# EAGLE schematic Main_v1 (EAGLE 9.7.0)
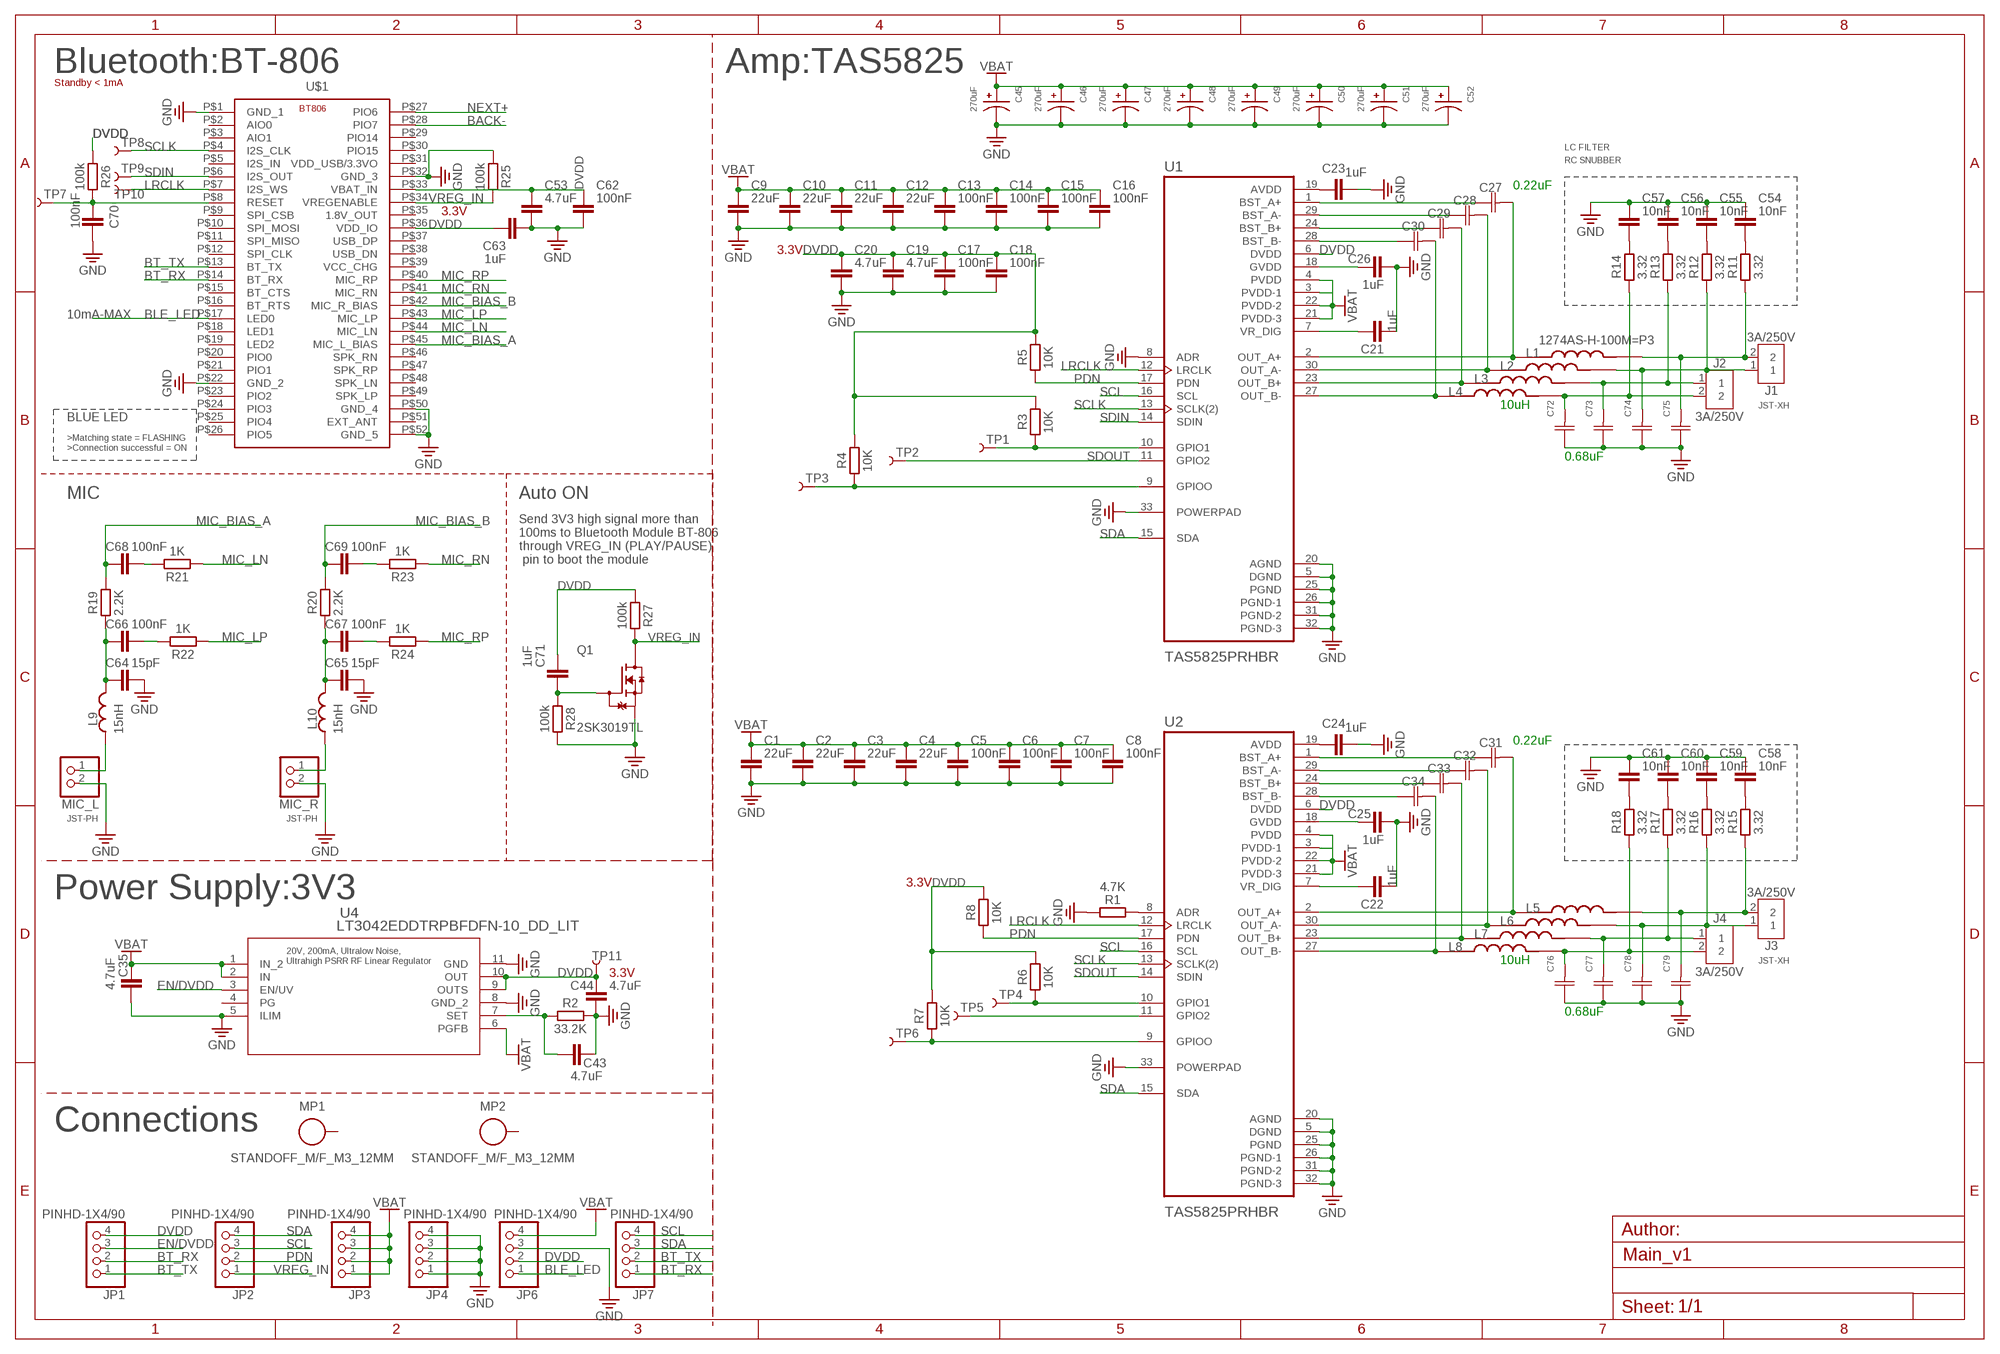
[diagram p0: schematic, sheet 1]

## Parts
C1  22uF  C_CHIP-0805(2012-METRIC)  [CAPC2012X110]
C2  22uF  C_CHIP-0805(2012-METRIC)  [CAPC2012X110]
C3  22uF  C_CHIP-0805(2012-METRIC)  [CAPC2012X110]
C4  22uF  C_CHIP-0805(2012-METRIC)  [CAPC2012X110]
C5  100nF  C_CHIP-0805(2012-METRIC)  [CAPC2012X110]
C6  100nF  C_CHIP-0805(2012-METRIC)  [CAPC2012X110]
C7  100nF  C_CHIP-0805(2012-METRIC)  [CAPC2012X110]
C8  100nF  C_CHIP-0805(2012-METRIC)  [CAPC2012X110]
C9  22uF  C_CHIP-0805(2012-METRIC)  [CAPC2012X110]
C10  22uF  C_CHIP-0805(2012-METRIC)  [CAPC2012X110]
C11  22uF  C_CHIP-0805(2012-METRIC)  [CAPC2012X110]
C12  22uF  C_CHIP-0805(2012-METRIC)  [CAPC2012X110]
C13  100nF  C_CHIP-0805(2012-METRIC)  [CAPC2012X110]
C14  100nF  C_CHIP-0805(2012-METRIC)  [CAPC2012X110]
C15  100nF  C_CHIP-0805(2012-METRIC)  [CAPC2012X110]
C16  100nF  C_CHIP-0805(2012-METRIC)  [CAPC2012X110]
C17  100nF  C_CHIP-0805(2012-METRIC)  [CAPC2012X110]
C18  100nF  C_CHIP-0805(2012-METRIC)  [CAPC2012X110]
C19  4.7uF  C_CHIP-1206(3216-METRIC)  [CAPC3216X135]
C20  4.7uF  C_CHIP-1206(3216-METRIC)  [CAPC3216X135]
C21  1uF  C_CHIP-0805(2012-METRIC)  [CAPC2012X110]
C22  1uF  C_CHIP-0805(2012-METRIC)  [CAPC2012X110]
C23  1uF  C_CHIP-0805(2012-METRIC)  [CAPC2012X110]
C24  1uF  C_CHIP-0805(2012-METRIC)  [CAPC2012X110]
C25  1uF  C_CHIP-0805(2012-METRIC)  [CAPC2012X110]
C26  1uF  C_CHIP-0805(2012-METRIC)  [CAPC2012X110]
C27  0.22uF  PHE426HJ6220JR05CAPM7.2X7.2_5_1_VIS  [CAPM7.2X7.2_5_1_VIS]
C28  0.22uF  PHE426HJ6220JR05CAPM7.2X7.2_5_1_VIS  [CAPM7.2X7.2_5_1_VIS]
C29  0.22uF  PHE426HJ6220JR05CAPM7.2X7.2_5_1_VIS  [CAPM7.2X7.2_5_1_VIS]
C30  0.22uF  PHE426HJ6220JR05CAPM7.2X7.2_5_1_VIS  [CAPM7.2X7.2_5_1_VIS]
C31  0.22uF  PHE426HJ6220JR05CAPM7.2X7.2_5_1_VIS  [CAPM7.2X7.2_5_1_VIS]
C32  0.22uF  PHE426HJ6220JR05CAPM7.2X7.2_5_1_VIS  [CAPM7.2X7.2_5_1_VIS]
C33  0.22uF  PHE426HJ6220JR05CAPM7.2X7.2_5_1_VIS  [CAPM7.2X7.2_5_1_VIS]
C34  0.22uF  PHE426HJ6220JR05CAPM7.2X7.2_5_1_VIS  [CAPM7.2X7.2_5_1_VIS]
C35  4.7uF  C_CHIP-0805(2012-METRIC)  [CAPC2012X110]
C43  4.7uF  C_CHIP-0805(2012-METRIC)  [CAPC2012X110]
C44  4.7uF  C_CHIP-0805(2012-METRIC)  [CAPC2012X110]
C45  270uF  16SVPG270M  [CAP_16SVPG270M]
C46  270uF  16SVPG270M  [CAP_16SVPG270M]
C47  270uF  16SVPG270M  [CAP_16SVPG270M]
C48  270uF  16SVPG270M  [CAP_16SVPG270M]
C49  270uF  16SVPG270M  [CAP_16SVPG270M]
C50  270uF  16SVPG270M  [CAP_16SVPG270M]
C51  270uF  16SVPG270M  [CAP_16SVPG270M]
C52  270uF  16SVPG270M  [CAP_16SVPG270M]
C53  4.7uF  C_CHIP-0805(2012-METRIC)  [CAPC2012X110]
C54  10nF  C_CHIP-0805(2012-METRIC)  [CAPC2012X110]
C55  10nF  C_CHIP-0805(2012-METRIC)  [CAPC2012X110]
C56  10nF  C_CHIP-0805(2012-METRIC)  [CAPC2012X110]
C57  10nF  C_CHIP-0805(2012-METRIC)  [CAPC2012X110]
C58  10nF  C_CHIP-0805(2012-METRIC)  [CAPC2012X110]
C59  10nF  C_CHIP-0805(2012-METRIC)  [CAPC2012X110]
C60  10nF  C_CHIP-0805(2012-METRIC)  [CAPC2012X110]
C61  10nF  C_CHIP-0805(2012-METRIC)  [CAPC2012X110]
C62  100nF  C_CHIP-0805(2012-METRIC)  [CAPC2012X110]
C63  1uF  C_CHIP-0805(2012-METRIC)  [CAPC2012X110]
C64  15pF  C_CHIP-0402(1005-METRIC)  [CAPC1005X60]
C65  15pF  C_CHIP-0402(1005-METRIC)  [CAPC1005X60]
C66  100nF  C_CHIP-0402(1005-METRIC)  [CAPC1005X60]
C67  100nF  C_CHIP-0402(1005-METRIC)  [CAPC1005X60]
C68  100nF  C_CHIP-0402(1005-METRIC)  [CAPC1005X60]
C69  100nF  C_CHIP-0402(1005-METRIC)  [CAPC1005X60]
C70  100nF  C_CHIP-0402(1005-METRIC)  [CAPC1005X60]
C71  1uF  C_CHIP-0805(2012-METRIC)  [CAPC2012X110]
C72  MMK5684J63J03L16.5TR18CAPM7.2X4.5_5_VIS  [CAPM7.2X4.5_5_VIS]
C73  MMK5684J63J03L16.5TR18CAPM7.2X4.5_5_VIS  [CAPM7.2X4.5_5_VIS]
C74  MMK5684J63J03L16.5TR18CAPM7.2X4.5_5_VIS  [CAPM7.2X4.5_5_VIS]
C75  MMK5684J63J03L16.5TR18CAPM7.2X4.5_5_VIS  [CAPM7.2X4.5_5_VIS]
C76  MMK5684J63J03L16.5TR18CAPM7.2X4.5_5_VIS  [CAPM7.2X4.5_5_VIS]
C77  MMK5684J63J03L16.5TR18CAPM7.2X4.5_5_VIS  [CAPM7.2X4.5_5_VIS]
C78  MMK5684J63J03L16.5TR18CAPM7.2X4.5_5_VIS  [CAPM7.2X4.5_5_VIS]
C79  MMK5684J63J03L16.5TR18CAPM7.2X4.5_5_VIS  [CAPM7.2X4.5_5_VIS]
J1  3A/250V  B2B-XH-A  [B2B-XH-A]
J2  3A/250V  B2B-XH-A  [B2B-XH-A]
J3  3A/250V  B2B-XH-A  [B2B-XH-A]
J4  3A/250V  B2B-XH-A  [B2B-XH-A]
JP1  PINHD-1X4/90  [1X04/90]
JP2  PINHD-1X4/90  [1X04/90]
JP3  PINHD-1X4/90  [1X04/90]
JP4  PINHD-1X4/90  [1X04/90]
JP6  PINHD-1X4/90  [1X04/90]
JP7  PINHD-1X4/90  [1X04/90]
L1  1274AS-H-100M=P3  [IND_1274AS-H-100M=P3]
L2  1274AS-H-100M=P3  [IND_1274AS-H-100M=P3]
L3  1274AS-H-100M=P3  [IND_1274AS-H-100M=P3]
L4  1274AS-H-100M=P3  [IND_1274AS-H-100M=P3]
L5  1274AS-H-100M=P3  [IND_1274AS-H-100M=P3]
L6  1274AS-H-100M=P3  [IND_1274AS-H-100M=P3]
L7  1274AS-H-100M=P3  [IND_1274AS-H-100M=P3]
L8  1274AS-H-100M=P3  [IND_1274AS-H-100M=P3]
L9  15nH  L_CHIP-0402(1006-METRIC)  [INDC1006X60N]
L10  15nH  L_CHIP-0402(1006-METRIC)  [INDC1006X60N]
MIC_L  JST_2PIN-THM  [JST-PH-2-THM]
MIC_R  JST_2PIN-THM  [JST-PH-2-THM]
MP1  STANDOFF_M/F_M3_12MM  [STANDOFF_HEX_MALE-FEMALE_550X1200_M3X0.5_MTGP850H320]
MP2  STANDOFF_M/F_M3_12MM  [STANDOFF_HEX_MALE-FEMALE_550X1200_M3X0.5_MTGP850H320]
Q1  2SK3019TL  [TRANS_2SK3019TL]
R1  4.7K  R_CHIP-0402(1005-METRIC)  [RESC1005X40]
R2  33.2K  R_CHIP-0402(1005-METRIC)  [RESC1005X40]
R3  10K  R_CHIP-0402(1005-METRIC)  [RESC1005X40]
R4  10K  R_CHIP-0402(1005-METRIC)  [RESC1005X40]
R5  10K  R_CHIP-0402(1005-METRIC)  [RESC1005X40]
R6  10K  R_CHIP-0402(1005-METRIC)  [RESC1005X40]
R7  10K  R_CHIP-0402(1005-METRIC)  [RESC1005X40]
R8  10K  R_CHIP-0402(1005-METRIC)  [RESC1005X40]
R11  3.32  R_CHIP-0402(1005-METRIC)  [RESC1005X40]
R12  3.32  R_CHIP-0402(1005-METRIC)  [RESC1005X40]
R13  3.32  R_CHIP-0402(1005-METRIC)  [RESC1005X40]
R14  3.32  R_CHIP-0402(1005-METRIC)  [RESC1005X40]
R15  3.32  R_CHIP-0402(1005-METRIC)  [RESC1005X40]
R16  3.32  R_CHIP-0402(1005-METRIC)  [RESC1005X40]
R17  3.32  R_CHIP-0402(1005-METRIC)  [RESC1005X40]
R18  3.32  R_CHIP-0402(1005-METRIC)  [RESC1005X40]
R19  2.2K  R_CHIP-0402(1005-METRIC)  [RESC1005X40]
R20  2.2K  R_CHIP-0402(1005-METRIC)  [RESC1005X40]
R21  1K  R_CHIP-0402(1005-METRIC)  [RESC1005X40]
R22  1K  R_CHIP-0402(1005-METRIC)  [RESC1005X40]
R23  1K  R_CHIP-0402(1005-METRIC)  [RESC1005X40]
R24  1K  R_CHIP-0402(1005-METRIC)  [RESC1005X40]
R25  100k  R_CHIP-0402(1005-METRIC)  [RESC1005X40]
R26  100k  R_CHIP-0402(1005-METRIC)  [RESC1005X40]
R27  100k  R_CHIP-0402(1005-METRIC)  [RESC1005X40]
R28  100k  R_CHIP-0402(1005-METRIC)  [RESC1005X40]
TP1  TEST-POINT3  [PAD.03X.03]
TP2  TEST-POINT3  [PAD.03X.03]
TP3  TEST-POINT3  [PAD.03X.03]
TP4  TEST-POINT3  [PAD.03X.03]
TP5  TEST-POINT3  [PAD.03X.03]
TP6  TEST-POINT3  [PAD.03X.03]
TP7  TEST-POINT3  [PAD.03X.03]
TP8  TEST-POINT3X5  [PAD.03X.05]
TP9  TEST-POINT3X5  [PAD.03X.05]
TP10  TEST-POINT3X5  [PAD.03X.05]
TP11  TEST-POINT3X5  [PAD.03X.05]
U1  TAS5825PRHBR  [IC_ADS125H01IRHBT]
U2  TAS5825PRHBR  [IC_ADS125H01IRHBT]
U4  LT3042EDDTRPBFDFN-10_DD_LIT  [DFN-10_DD_LIT]
U$1  BT806  [BT806]

## Nets
BACK-: U$1.P$28(PIO7)
BLE_LED: JP6.1 U$1.P$17(LED0)
BT_RX: JP1.2 JP7.1 U$1.P$14(BT_RX)
BT_TX: JP1.1 JP7.2 U$1.P$13(BT_TX)
DVDD: C17.1 C18.1 C19.1 C20.1 C44.2 C53.1 C62.1 C63.1 C71.1 JP1.4 JP6.2 R3.2 R4.2 R5.2 R6.2 R7.2 R8.2 R26.1 R27.1 TP11.P$1 U1.6(DVDD) U2.6(DVDD) U4.9(OUTS) U4.10(OUT) U$1.P$33(VBAT_IN) U$1.P$36(VDD_IO)
EN/DVDD: JP1.3 U4.3(EN/UV)
GND: C1.2 C2.2 C3.2 C4.2 C5.2 C6.2 C7.2 C8.2 C9.2 C10.2 C11.2 C12.2 C13.2 C14.2 C15.2 C16.2 C17.2 C18.2 C19.2 C20.2 C21.2 C22.2 C23.2 C24.2 C25.2 C26.2 C35.1 C43.2 C44.1 C45.2 C46.2 C47.2 C48.2 C49.2 C50.2 C51.2 C52.2 C53.2 C54.1 C55.1 C56.1 C57.1 C58.1 C59.1 C60.1 C61.1 C62.2 C63.2 C64.2 C65.2 C70.1 C72.1 C73.1 C74.1 C75.1 C76.1 C77.1 C78.1 C79.1 JP4.1 JP4.2 JP4.3 JP4.4 JP6.3 MIC_L.2 MIC_R.2 Q1.1(S) R1.1 R2.2 R25.1 R28.2 U1.5(DGND) U1.8(ADR) U1.20(AGND) U1.25(PGND) U1.26(PGND-1) U1.31(PGND-2) U1.32(PGND-3) U1.33(POWERPAD) U2.5(DGND) U2.20(AGND) U2.25(PGND) U2.26(PGND-1) U2.31(PGND-2) U2.32(PGND-3) U2.33(POWERPAD) U4.5(ILIM) U4.8(GND_2) U4.11(GND) U$1.P$1(GND_1) U$1.P$22(GND_2) U$1.P$32(GND_3) U$1.P$50(GND_4) U$1.P$52(GND_5)
LRCLK: TP10.P$1 U1.12(LRCLK) U2.12(LRCLK) U$1.P$7(I2S_WS)
MIC_BIAS_A: C68.1 R19.2 U$1.P$45(MIC_L_BIAS)
MIC_BIAS_B: C69.1 R20.2 U$1.P$42(MIC_R_BIAS)
MIC_LN: R21.1 U$1.P$44(MIC_LN)
MIC_LP: R22.1 U$1.P$43(MIC_LP)
MIC_RN: R23.1 U$1.P$41(MIC_RN)
MIC_RP: R24.1 U$1.P$40(MIC_RP)
N$1: R1.2 U2.8(ADR)
N$2: C24.1 U2.19(AVDD)
N$3: C23.1 U1.19(AVDD)
N$4: C26.1 U1.18(GVDD)
N$5: C21.1 U1.7(VR_DIG)
N$6: C25.1 U2.18(GVDD)
N$7: C22.1 U2.7(VR_DIG)
N$8: C27.1 U1.1(BST_A+)
N$9: C28.1 U1.29(BST_A-)
N$10: C29.1 U1.24(BST_B+)
N$11: C30.1 U1.28(BST_B-)
N$12: C31.1 U2.1(BST_A+)
N$13: C32.1 U2.29(BST_A-)
N$14: C33.1 U2.24(BST_B+)
N$15: C34.1 U2.28(BST_B-)
N$16: C27.2 L1.1 U1.2(OUT_A+)
N$17: C28.2 L2.1 U1.30(OUT_A-)
N$18: C29.2 L3.1 U1.23(OUT_B+)
N$19: C30.2 L4.1 U1.27(OUT_B-)
N$20: C31.2 L5.1 U2.2(OUT_A+)
N$21: C32.2 L6.1 U2.30(OUT_A-)
N$22: C33.2 L7.1 U2.23(OUT_B+)
N$23: C34.2 L8.1 U2.27(OUT_B-)
N$24: C77.2 J4.1 L7.2 R17.1
N$25: C78.2 J3.1 L6.2 R16.1
N$26: C79.2 J3.2 L5.2 R15.1
N$27: C72.2 J2.2 L4.2 R14.1
N$28: C75.2 J1.2 L1.2 R11.1
N$29: C76.2 J4.2 L8.2 R18.1
N$30: C74.2 J1.1 L2.2 R12.1
N$31: C73.2 J2.1 L3.2 R13.1
N$32: C43.1 R2.1 U4.7(SET)
N$34: R3.1 TP1.P$1 U1.10(GPIO1)
N$35: R6.1 TP4.P$1 U2.10(GPIO1)
N$36: R4.1 TP3.P$1 U1.9(GPIOO)
N$37: TP5.P$1 U2.11(GPIO2)
N$38: R7.1 TP6.P$1 U2.9(GPIOO)
N$43: C54.2 R11.2
N$44: C55.2 R12.2
N$45: C56.2 R13.2
N$46: C57.2 R14.2
N$47: C58.2 R15.2
N$48: C59.2 R16.2
N$49: C60.2 R17.2
N$50: C61.2 R18.2
N$51: L9.1 MIC_L.1
N$54: L10.1 MIC_R.1
N$55: C64.1 C66.1 L9.2 R19.1
N$56: C70.2 R26.2 TP7.P$1 U$1.P$8(RESET)
N$58: C66.2 R22.2
N$59: C69.2 R23.2
N$60: C67.2 R24.2
N$61: C68.2 R21.2
N$63: C71.2 Q1.2(G) R28.1
N$64: C65.1 C67.1 L10.2 R20.1
NEXT+: U$1.P$27(PIO6)
PDN: JP2.2 R5.1 R8.1 U1.17(PDN) U2.17(PDN)
SCL: JP2.3 JP7.4 U1.16(SCL) U2.16(SCL)
SCLK: TP8.P$1 U1.13(SCLK(2)) U2.13(SCLK(2)) U$1.P$4(I2S_CLK)
SDA: JP2.4 JP7.3 U1.15(SDA) U2.15(SDA)
SDIN: TP9.P$1 U1.14(SDIN) U$1.P$6(I2S_OUT)
SDOUT: TP2.P$1 U1.11(GPIO2) U2.14(SDIN)
VCC: C1.1 C2.1 C3.1 C4.1 C5.1 C6.1 C7.1 C8.1 C9.1 C10.1 C11.1 C12.1 C13.1 C14.1 C15.1 C16.1 C35.2 C45.1 C46.1 C47.1 C48.1 C49.1 C50.1 C51.1 C52.1 JP3.1 JP3.2 JP3.3 JP3.4 JP6.4 U1.3(PVDD-1) U1.4(PVDD) U1.21(PVDD-3) U1.22(PVDD-2) U2.3(PVDD-1) U2.4(PVDD) U2.21(PVDD-3) U2.22(PVDD-2) U4.1(IN_2) U4.2(IN) U4.6(PGFB) ; supply symbol labelled VBAT
VREG_IN: JP2.1 Q1.3(D) R25.2 R27.2 U$1.P$34(VREGENABLE)
Unconnected: MP1.1 MP2.1 U$1.P$2(AIO0) U$1.P$3(AIO1) U$1.P$5(I2S_IN) U$1.P$9(SPI_CSB) U$1.P$10(SPI_MOSI) U$1.P$11(SPI_MISO) U$1.P$12(SPI_CLK) U$1.P$15(BT_CTS) U$1.P$16(BT_RTS) U$1.P$18(LED1) U$1.P$19(LED2) U$1.P$20(PIO0) U$1.P$21(PIO1) U$1.P$23(PIO2) U$1.P$24(PIO3) U$1.P$25(PIO4) U$1.P$26(PIO5) U$1.P$29(PIO14) U$1.P$30(PIO15) U$1.P$31(VDD_USB/3.3VO) U$1.P$35(1.8V_OUT) U$1.P$37(USB_DP) U$1.P$38(USB_DN) U$1.P$39(VCC_CHG) U$1.P$46(SPK_RN) U$1.P$47(SPK_RP) U$1.P$48(SPK_LN) U$1.P$49(SPK_LP) U$1.P$51(EXT_ANT)

## Notes on the sheet
- Bluetooth:BT-806 | Amp:TAS5825
- Standby < 1mA
- LC FILTER
- RC SNUBBER
- 0.22uF
- 3.3V
- 3.3V
- 10mA-MAX
- 10uH | JST-XH
- BLUE LED
- >Matching state = FLASHING
  >Connection successful = ON
- 0.68uF
- MIC | Auto ON
- Send 3V3 high signal more than 
  100ms to Bluetooth Module BT-806 
  through VREG_IN (PLAY/PAUSE)
   pin to boot the module
- 0.22uF
- JST-PH | JST-PH
- 3.3V
- Power Supply:3V3
- 20V, 200mA, Ultralow Noise,
  Ultrahigh PSRR RF Linear Regulator
- 10uH | JST-XH
- 3.3V
- 0.68uF
- Connections

## Power pins joined to a net without a drawn wire
PG: U4.4(PG)

## Library data of the parts
C1-C26 C35 C43 C44 C53-C71 = Capacitor:C: Capacitor - Generic; CATEGORY: Capacitor
C27-C34 = 0.22uF:PHE426HJ6220JR05; COPYRIGHT: Copyright (C) 2021 Ultra Librarian. All rights reserved.; DIGI-KEY_PART_NUMBER_1: 399-PHE426HJ6220JR05-ND; MANUFACTURER_PART_NUMBER: PHE426HJ6220JR05; MFR_NAME: Vishay
C45-C52 = 16SVPG270M:16SVPG270M; MANUFACTURER: Panasonic; MAXIMUM_PACKAGE_HEIGHT: 9.9mm; PARTREV: 05-Mar-21; STANDARD: Manufacturer Recommendations
C72-C79 = MMK5684J63J03L16.5TR18:MMK5684J63J03L16.5TR18; COPYRIGHT: Copyright (C) 2022 Ultra Librarian. All rights reserved.; DIGI-KEY_PART_NUMBER_1: 399-MMK5684J63J03L16.5TR18CT-ND; DIGI-KEY_PART_NUMBER_2: 399-MMK5684J63J03L16.5TR18DKR-ND; DIGI-KEY_PART_NUMBER_3: 399-MMK5684J63J03L16.5TR18TR-ND; MANUFACTURER_PART_NUMBER: MMK5684J63J03L16.5TR18; MFR_NAME: Vishay
J1-J4 = Connector:B2B-XH-A: XH Connector Top Entry - 2POS Details see: Datasheet <http://www.jst-mfg.com/product/pdf/eng/eXH.pdf>; CATEGORY: CONNECTOR; DESCRIPTION: 2.5mm pitch/disconnectable crimp style connector; MANUFACTURER: JST (XH CONNECTOR); MPN: B2B-XH-A; OPERATING_TEMPERATURE: -25°C ~ 85°C; PART_STATUS: ACTIVE; ROHS_COMPLIANT: COMPLIANT; SERIES: B_B-XH-A; SUB_CATEGORY: Through hole connector; TYPE: top entry
JP1-JP4 JP6 JP7 = Connector:PINHD-1X4: PIN HEADER; CATEGORY: CONNECTOR; SUB-CATEGORY: PIN-HEADER
L1-L8 = 1274AS-H-100M_P3:1274AS-H-100M=P3: Inductor Power Shielded Wirewound 22uH 20% 100KHz Ferrite 2.9A 68.1mOhm DCR 3939 T/R; MANUFACTURER: Murata; MAXIMUM_PACKAGE_HEIGHT: 5.0 mm; PARTREV: N/A; STANDARD: Manufacturer Recommendations
L9 L10 = Inductor:L: Inductor Fixed - Generic; CATEGORY: Inductor; SUB-CATEGORY: Fixed
MIC_L MIC_R = adafruit:JST_2PIN: JST 2-Pin Connectors of various flavors SMT-RA (S2B-PH-SM4) 4UConnector #17311 SMT (B2B-PH-SM4) THM-RA (S2B-PH) THM (B2B-PH)
MP1 MP2 = PCB-Fasteners_Hardware:STANDOFF_M/F: Male-Male Standoff/Spacer with Mounting pad and hole. Essentra : Male-Female Standoff <https://www.essentracomponents.co.in/index.php?option=com_virtuemart&view=productdetails&virtuemart_product_id=14556> The hole and pad sizes may vary based on the application and type of hardware; always verify the Manufacturer specification or Global Standards.; CATEGORY: Standoff/Spacer; SUB-CATEGORY: Male-Female
Q1 = 2SK3019TL:2SK3019TL: Single N-Channel 150 mW 30 V 13 Ohm Surface Mount MosFet - EMT-3; MANUFACTURER: ROHM; MAXIMUM_PACKAGE_HEIGHT: 0.8mm; PARTREV: A; STANDARD: Manufacturer recommendations
R1-R8 R11-R28 = Resistor:R: Resistor Fixed - Generic; CATEGORY: Resistor; SUB-CATEGORY: Fixed
TP1-TP11 = SparkFun-Connectors:TEST-POINT: SparkFun Test Points Bare copper test points for troubleshooting or In-Circuit-Testing. These are used by our Production team for verifying production board runs using pogo-pins on test beds. SparkFun Products: SparkFun LSM9DS1 Breakout <https://www.sparkfun.com/products/13284> SparkFun PSOC <https://www.sparkfun.com/products/13714> SparkFun Load Cell Amplifier <https://www.sparkfun.com/products/13879>
U1 U2 = TAS5825PRHBR:TAS5825PRHBR
U4 = LT3042EDD#TRPBF:LT3042EDDTRPBF; COPYRIGHT: Copyright (C) 2021 Ultra Librarian. All rights reserved.; DIGI-KEY_PART_NUMBER_1: LT3042EDD#TRPBFCT-ND; DIGI-KEY_PART_NUMBER_2: LT3042EDD#TRPBFDKR-ND; DIGI-KEY_PART_NUMBER_3: LT3042EDD#TRPBFTR-ND; MANUFACTURER_PART_NUMBER: LT3042EDD#TRPBF; MFR_NAME: Analog Devices / Linear Technology
U$1 = BT806:BT806